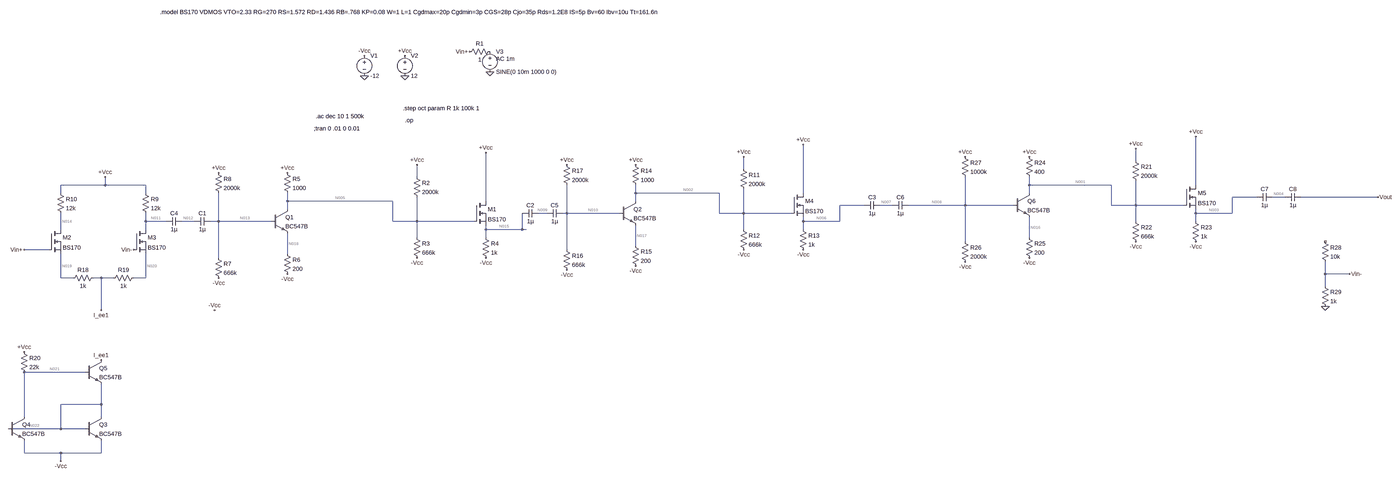
[diagram p0: schematic Draft1.asc, whole sheet]
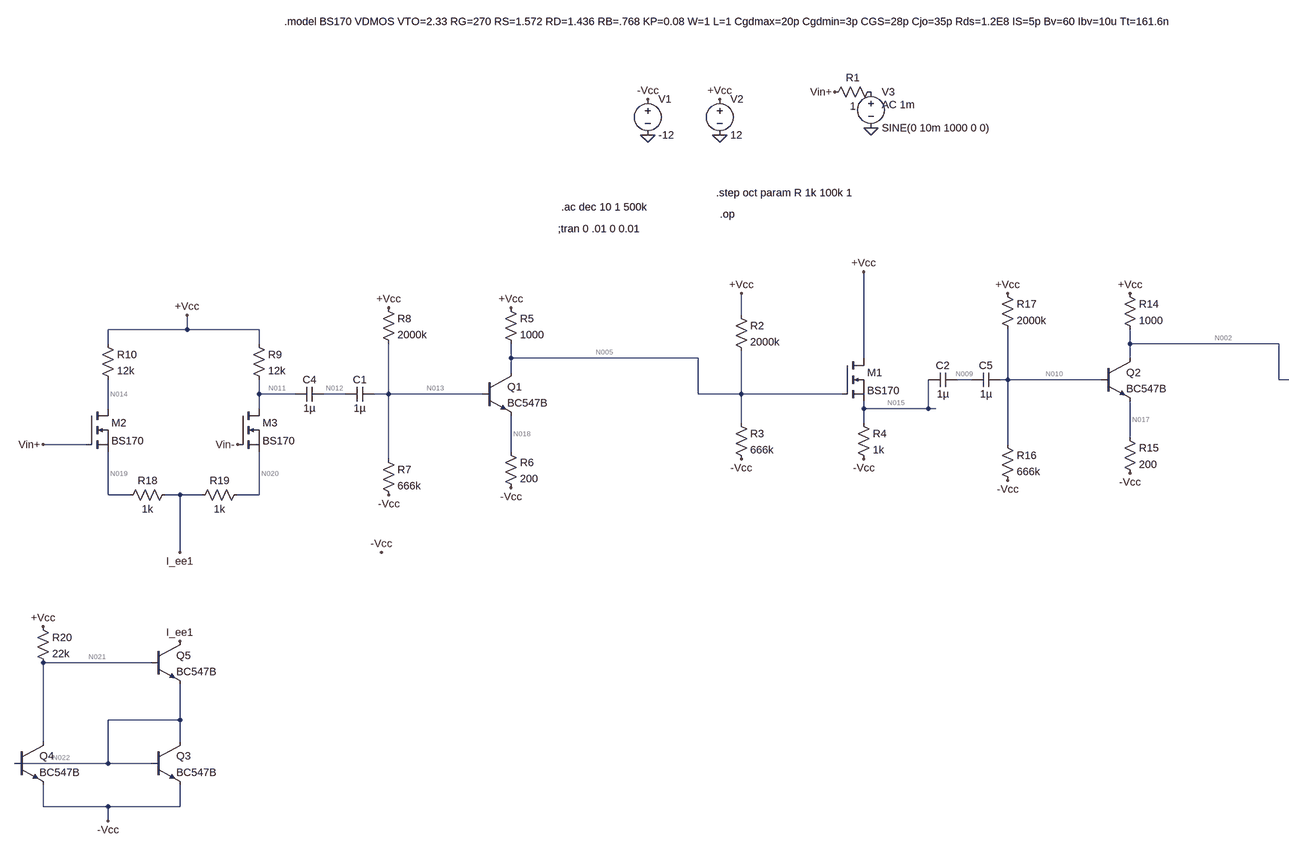
[diagram p1: schematic Draft1.asc, part, row 1 of 1, column 1 of 2]
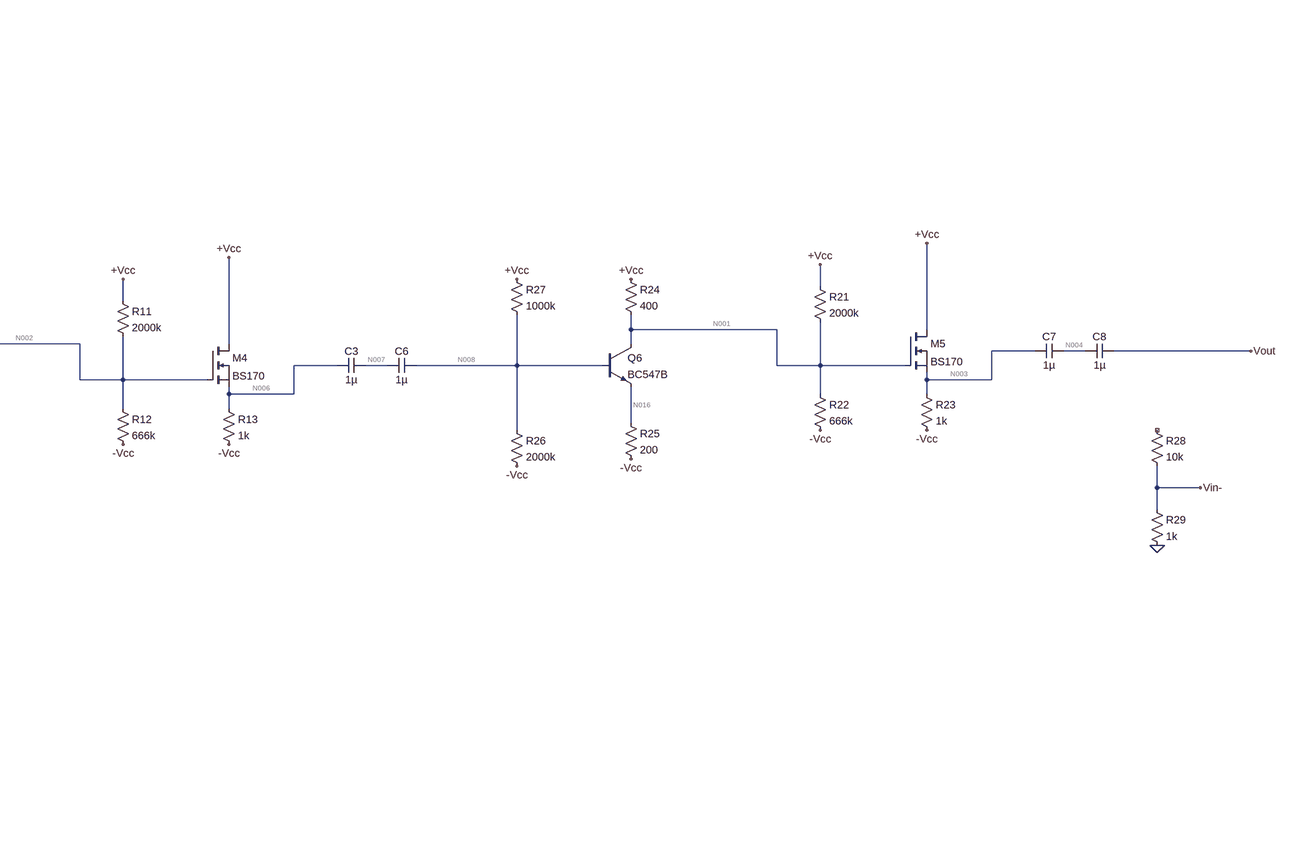
[diagram p2: schematic Draft1.asc, part, row 1 of 1, column 2 of 2]
Draft1.asc, the LTspice schematic file:
Version 4
SHEET 1 4264 680
WIRE 3200 -1136 3200 -1184
WIRE 1504 -1104 1504 -1152
WIRE 128 -1072 128 -1120
WIRE -1104 -1040 -1104 -1072
WIRE -1104 -1040 -1280 -1040
WIRE -944 -1040 -1104 -1040
WIRE 2688 -1040 2688 -1072
WIRE 3104 -1040 2688 -1040
WIRE 3472 -1040 3472 -1232
WIRE -1280 -1008 -1280 -1040
WIRE -944 -1008 -944 -1040
WIRE 992 -1008 992 -1040
WIRE 1408 -1008 992 -1008
WIRE 1776 -1008 1776 -1200
WIRE 2688 -1008 2688 -1040
WIRE 3712 -992 3616 -992
WIRE 3824 -992 3776 -992
WIRE 4192 -992 3888 -992
WIRE -384 -976 -384 -1008
WIRE 32 -976 -384 -976
WIRE 400 -976 400 -1168
WIRE 992 -976 992 -1008
WIRE 2016 -960 1920 -960
WIRE 2128 -960 2080 -960
WIRE 2416 -960 2416 -1072
WIRE 2416 -960 2192 -960
WIRE 2624 -960 2416 -960
WIRE 3104 -960 3104 -1040
WIRE 3200 -960 3200 -1056
WIRE 3200 -960 3104 -960
WIRE 3424 -960 3200 -960
WIRE -384 -944 -384 -976
WIRE 640 -928 608 -928
WIRE 720 -928 720 -1040
WIRE 720 -928 704 -928
WIRE 928 -928 720 -928
WIRE 1408 -928 1408 -1008
WIRE 1504 -928 1504 -1024
WIRE 1504 -928 1408 -928
WIRE 1728 -928 1504 -928
WIRE 3472 -928 3472 -944
WIRE 3616 -928 3616 -992
WIRE 3616 -928 3472 -928
WIRE -944 -896 -944 -928
WIRE -864 -896 -944 -896
WIRE -752 -896 -800 -896
WIRE -656 -896 -656 -1008
WIRE -656 -896 -688 -896
WIRE -448 -896 -656 -896
WIRE 32 -896 32 -976
WIRE 128 -896 128 -992
WIRE 128 -896 32 -896
WIRE 352 -896 128 -896
WIRE 1776 -896 1776 -912
WIRE 1920 -896 1920 -960
WIRE 1920 -896 1776 -896
WIRE 3200 -896 3200 -960
WIRE 3472 -896 3472 -928
WIRE -1280 -864 -1280 -928
WIRE -944 -864 -944 -896
WIRE 400 -864 400 -880
WIRE 544 -864 544 -928
WIRE 544 -864 400 -864
WIRE 560 -864 544 -864
WIRE 1504 -864 1504 -928
WIRE 1776 -864 1776 -896
WIRE 128 -832 128 -896
WIRE 400 -832 400 -864
WIRE 2688 -832 2688 -912
WIRE 2416 -816 2416 -960
WIRE 992 -800 992 -880
WIRE -1328 -784 -1424 -784
WIRE 720 -784 720 -928
WIRE -384 -768 -384 -848
WIRE -656 -752 -656 -896
WIRE 3984 -688 3984 -736
WIRE 4080 -688 3984 -688
WIRE -1280 -672 -1280 -768
WIRE -1232 -672 -1280 -672
WIRE -1120 -672 -1152 -672
WIRE -1072 -672 -1120 -672
WIRE -944 -672 -944 -768
WIRE -944 -672 -992 -672
WIRE 3984 -640 3984 -688
WIRE -1120 -544 -1120 -672
WIRE -1184 -144 -1424 -144
WIRE -1120 -16 -1120 -96
WIRE -1120 -16 -1280 -16
WIRE -1424 32 -1424 -144
WIRE -1120 32 -1120 -16
WIRE -1280 80 -1280 -16
WIRE -1280 80 -1488 80
WIRE -1184 80 -1280 80
WIRE -1424 176 -1424 128
WIRE -1280 176 -1424 176
WIRE -1120 176 -1120 128
WIRE -1120 176 -1280 176
WIRE -1280 208 -1280 176
FLAG -80 -1472 0
FLAG 80 -1472 0
FLAG -80 -1552 -Vcc
FLAG 80 -1552 +Vcc
FLAG 416 -1488 0
FLAG 336 -1568 Vin+
FLAG 128 -1120 +Vcc
FLAG 400 -1168 +Vcc
FLAG -656 -1088 +Vcc
FLAG -384 -1088 +Vcc
FLAG -1104 -1072 +Vcc
FLAG 1504 -1152 +Vcc
FLAG 1776 -1200 +Vcc
FLAG 720 -1120 +Vcc
FLAG 992 -1120 +Vcc
FLAG -1424 -784 Vin+
FLAG -1280 208 -Vcc
FLAG -1424 -224 +Vcc
FLAG -1120 -192 I_ee1
FLAG -1120 -544 I_ee1
FLAG -672 -544 -Vcc
FLAG -656 -672 -Vcc
FLAG -384 -688 -Vcc
FLAG 128 -752 -Vcc
FLAG 400 -752 -Vcc
FLAG 720 -704 -Vcc
FLAG 992 -720 -Vcc
FLAG 1504 -784 -Vcc
FLAG 1776 -784 -Vcc
FLAG -992 -784 Vin-
FLAG 3200 -1184 +Vcc
FLAG 3472 -1232 +Vcc
FLAG 2416 -1152 +Vcc
FLAG 2688 -1152 +Vcc
FLAG 4192 -992 Vout
FLAG 2416 -736 -Vcc
FLAG 2688 -752 -Vcc
FLAG 3200 -816 -Vcc
FLAG 3472 -816 -Vcc
FLAG 4080 -688 Vin-
FLAG 3984 -560 0
SYMBOL voltage -80 -1568 R0
WINDOW 123 0 0 Left 0
WINDOW 39 0 0 Left 0
SYMATTR InstName V1
SYMATTR Value -12
SYMBOL voltage 80 -1568 R0
WINDOW 123 0 0 Left 0
WINDOW 39 0 0 Left 0
SYMATTR InstName V2
SYMATTR Value 12
SYMBOL voltage 416 -1584 R0
WINDOW 123 24 44 Left 2
WINDOW 39 0 0 Left 0
SYMATTR Value2 AC 1m
SYMATTR InstName V3
SYMATTR Value SINE(0 10m 1000 0 0)
SYMBOL res 432 -1584 R90
WINDOW 0 0 56 VBottom 2
WINDOW 3 32 56 VTop 2
SYMATTR InstName R1
SYMATTR Value 1
SYMBOL nmos 352 -976 R0
SYMATTR InstName M1
SYMATTR Value BS170
SYMBOL res 112 -1088 R0
SYMATTR InstName R2
SYMATTR Value 2000k
SYMBOL res 112 -848 R0
SYMATTR InstName R3
SYMATTR Value 666k
SYMBOL res 384 -848 R0
SYMATTR InstName R4
SYMATTR Value 1k
SYMBOL npn -448 -944 R0
SYMATTR InstName Q1
SYMATTR Value BC547B
SYMBOL res -400 -1104 R0
SYMATTR InstName R5
SYMATTR Value 1000
SYMBOL res -400 -784 R0
SYMATTR InstName R6
SYMATTR Value 200
SYMBOL res -672 -768 R0
SYMATTR InstName R7
SYMATTR Value 666k
SYMBOL res -672 -1104 R0
SYMATTR InstName R8
SYMATTR Value 2000k
SYMBOL nmos -1328 -864 R0
SYMATTR InstName M2
SYMATTR Value BS170
SYMBOL res -960 -1024 R0
SYMATTR InstName R9
SYMATTR Value 12k
SYMBOL res -1296 -1024 R0
SYMATTR InstName R10
SYMATTR Value 12k
SYMBOL nmos -992 -864 R0
SYMATTR InstName M3
SYMATTR Value BS170
SYMBOL cap -688 -912 R90
WINDOW 0 0 32 VBottom 2
WINDOW 3 32 32 VTop 2
SYMATTR InstName C1
SYMATTR Value 1µ
SYMBOL nmos 1728 -1008 R0
SYMATTR InstName M4
SYMATTR Value BS170
SYMBOL res 1488 -1120 R0
SYMATTR InstName R11
SYMATTR Value 2000k
SYMBOL res 1488 -880 R0
SYMATTR InstName R12
SYMATTR Value 666k
SYMBOL res 1760 -880 R0
SYMATTR InstName R13
SYMATTR Value 1k
SYMBOL npn 928 -976 R0
SYMATTR InstName Q2
SYMATTR Value BC547B
SYMBOL res 976 -1136 R0
SYMATTR InstName R14
SYMATTR Value 1000
SYMBOL res 976 -816 R0
SYMATTR InstName R15
SYMATTR Value 200
SYMBOL res 704 -800 R0
SYMATTR InstName R16
SYMATTR Value 666k
SYMBOL res 704 -1136 R0
SYMATTR InstName R17
SYMATTR Value 2000k
SYMBOL res -1136 -688 R90
WINDOW 0 0 56 VBottom 2
WINDOW 3 32 56 VTop 2
SYMATTR InstName R18
SYMATTR Value 1k
SYMBOL res -976 -688 R90
WINDOW 0 0 56 VBottom 2
WINDOW 3 32 56 VTop 2
SYMATTR InstName R19
SYMATTR Value 1k
SYMBOL npn -1184 32 R0
SYMATTR InstName Q3
SYMATTR Value BC547B
SYMBOL npn -1488 32 R0
SYMATTR InstName Q4
SYMATTR Value BC547B
SYMBOL npn -1184 -192 R0
SYMATTR InstName Q5
SYMATTR Value BC547B
SYMBOL res -1440 -240 R0
SYMATTR InstName R20
SYMATTR Value 22k
SYMBOL cap 608 -944 R90
WINDOW 0 0 32 VBottom 2
WINDOW 3 32 32 VTop 2
SYMATTR InstName C2
SYMATTR Value 1µ
SYMBOL cap 2080 -976 R90
WINDOW 0 0 32 VBottom 2
WINDOW 3 32 32 VTop 2
SYMATTR InstName C3
SYMATTR Value 1µ
SYMBOL cap -800 -912 R90
WINDOW 0 0 32 VBottom 2
WINDOW 3 32 32 VTop 2
SYMATTR InstName C4
SYMATTR Value 1µ
SYMBOL cap 704 -944 R90
WINDOW 0 0 32 VBottom 2
WINDOW 3 32 32 VTop 2
SYMATTR InstName C5
SYMATTR Value 1µ
SYMBOL cap 2192 -976 R90
WINDOW 0 0 32 VBottom 2
WINDOW 3 32 32 VTop 2
SYMATTR InstName C6
SYMATTR Value 1µ
SYMBOL nmos 3424 -1040 R0
SYMATTR InstName M5
SYMATTR Value BS170
SYMBOL res 3184 -1152 R0
SYMATTR InstName R21
SYMATTR Value 2000k
SYMBOL res 3184 -912 R0
SYMATTR InstName R22
SYMATTR Value 666k
SYMBOL res 3456 -912 R0
SYMATTR InstName R23
SYMATTR Value 1k
SYMBOL npn 2624 -1008 R0
SYMATTR InstName Q6
SYMATTR Value BC547B
SYMBOL res 2672 -1168 R0
SYMATTR InstName R24
SYMATTR Value 400
SYMBOL res 2672 -848 R0
SYMATTR InstName R25
SYMATTR Value 200
SYMBOL res 2400 -832 R0
SYMATTR InstName R26
SYMATTR Value 2000k
SYMBOL res 2400 -1168 R0
SYMATTR InstName R27
SYMATTR Value 1000k
SYMBOL cap 3776 -1008 R90
WINDOW 0 0 32 VBottom 2
WINDOW 3 32 32 VTop 2
SYMATTR InstName C7
SYMATTR Value 1µ
SYMBOL cap 3888 -1008 R90
WINDOW 0 0 32 VBottom 2
WINDOW 3 32 32 VTop 2
SYMATTR InstName C8
SYMATTR Value 1µ
SYMBOL res 3968 -832 R0
SYMATTR InstName R28
SYMATTR Value 10k
SYMBOL res 3968 -656 R0
SYMATTR InstName R29
SYMATTR Value 1k
TEXT -280 -1264 Left 2 !;tran 0 .01 0 0.01
TEXT -888 -1760 Left 2 !.model BS170 VDMOS VTO=2.33 RG=270 RS=1.572 RD=1.436 RB=.768 KP=0.08 W=1 L=1 Cgdmax=20p Cgdmin=3p CGS=28p Cjo=35p Rds=1.2E8 IS=5p Bv=60 Ibv=10u Tt=161.6n
TEXT -272 -1312 Left 2 !.ac dec 10 1 500k
TEXT 72 -1344 Left 2 !.step oct param R 1k 100k 1
TEXT 80 -1296 Left 2 !.op

The netlist it stands for:
* Draft1.asc
V1 -Vcc 0 -12
V2 +Vcc 0 12
V3 P001 0 SINE(0 10m 1000 0 0) AC 1m
R1 P001 Vin+ 1
M1 +Vcc N005 N015 N015 BS170
R2 +Vcc N005 2000k
R3 N005 -Vcc 666k
R4 N015 -Vcc 1k
Q1 N005 N013 N018 0 BC547B
R5 +Vcc N005 1000
R6 N018 -Vcc 200
R7 N013 -Vcc 666k
R8 +Vcc N013 2000k
M2 N014 Vin+ N019 N019 BS170
R9 +Vcc N011 12k
R10 +Vcc N014 12k
M3 N011 Vin- N020 N020 BS170
C1 N013 N012 1µ
M4 +Vcc N002 N006 N006 BS170
R11 +Vcc N002 2000k
R12 N002 -Vcc 666k
R13 N006 -Vcc 1k
Q2 N002 N010 N017 0 BC547B
R14 +Vcc N002 1000
R15 N017 -Vcc 200
R16 N010 -Vcc 666k
R17 +Vcc N010 2000k
R18 I_ee1 N019 1k
R19 N020 I_ee1 1k
Q3 N022 N022 -Vcc 0 BC547B
Q4 N021 N022 -Vcc 0 BC547B
Q5 I_ee1 N021 N022 0 BC547B
R20 +Vcc N021 22k
C2 N009 N015 1µ
C3 N007 N006 1µ
C4 N012 N011 1µ
C5 N010 N009 1µ
C6 N008 N007 1µ
M5 +Vcc N001 N003 N003 BS170
R21 +Vcc N001 2000k
R22 N001 -Vcc 666k
R23 N003 -Vcc 1k
Q6 N001 N008 N016 0 BC547B
R24 +Vcc N001 400
R25 N016 -Vcc 200
R26 N008 -Vcc 2000k
R27 +Vcc N008 1000k
C7 N004 N003 1µ
C8 Vout N004 1µ
R28 NC_01 Vin- 10k
R29 Vin- 0 1k
.model NPN NPN
.model PNP PNP
.lib standard.bjt
.model NMOS NMOS
.model PMOS PMOS
.lib standard.mos
;tran 0 .01 0 0.01
.model BS170 VDMOS VTO=2.33 RG=270 RS=1.572 RD=1.436 RB=.768 KP=0.08 W=1 L=1 Cgdmax=20p Cgdmin=3p CGS=28p Cjo=35p Rds=1.2E8 IS=5p Bv=60 Ibv=10u Tt=161.6n
.ac dec 10 1 500k
.step oct param R 1k 100k 1
.op
.backanno
.end

* Results of the author's LTspice run, read from the files saved beside the schematic
* Operating Point (first step), zero values left out:
*   r = 1 k
*   V(-vcc) = -12 V
*   V(+vcc) = 12 V
*   V(n005) = 8.562 V
*   V(n015) = 5.542 V
*   V(n013) = -10.65 V
*   V(n018) = -11.32 V
*   V(n014) = 5.86 V
*   V(n019) = -2.444 V
*   V(n011) = 5.86 V
*   V(n020) = -2.444 V
*   V(n012) = -4.791 µV
*   V(n002) = 8.562 V
*   V(n006) = 5.542 V
*   V(n010) = -10.65 V
*   V(n017) = -11.32 V
*   V(i_ee1) = -2.956 V
*   V(n022) = -11.36 V
*   V(n021) = -10.72 V
*   V(n009) = -5.109 µV
*   V(n007) = -4.284 µV
*   V(n008) = -9.826 V
*   V(n001) = 9.025 V
*   V(n003) = 5.996 V
*   V(n016) = -10.51 V
*   V(n004) = 5.996 µV
*   Ic(Q6) = 7.406 mA
*   Ib(Q6) = 20.74 µA
*   Ie(Q6) = -7.427 mA
*   Ic(Q5) = 1.023 mA
*   Ib(Q5) = 3.218 µA
*   Ie(Q5) = -1.027 mA
*   Ic(Q4) = 1.03 mA
*   Ib(Q4) = 3.611 µA
*   Ie(Q4) = -1.033 mA
*   Ic(Q3) = 1.019 mA
*   Ib(Q3) = 3.611 µA
*   Ie(Q3) = -1.023 mA
*   Ic(Q2) = 3.409 mA
*   Ib(Q2) = 9.3 µA
*   Ie(Q2) = -3.418 mA
*   Ic(Q1) = 3.409 mA
*   Ib(Q1) = 9.3 µA
*   Ie(Q1) = -3.418 mA
*   Id(M5) = 18 mA
*   Ig(M5) = -5.162 pA
*   Is(M5) = -18 mA
*   Id(M4) = 17.54 mA
*   Ig(M4) = -4.885 pA
*   Is(M4) = -17.54 mA
*   Id(M3) = 511.7 µA
*   Ig(M3) = -4.118 pA
*   Is(M3) = -511.7 µA
*   Id(M2) = 511.7 µA
*   Ig(M2) = -4.118 pA
*   Is(M2) = -511.7 µA
*   Id(M1) = 17.54 mA
*   Ig(M1) = -4.885 pA
*   Is(M1) = -17.54 mA
*   I(R27) = 21.83 µA
*   I(R26) = 1.087 µA
*   I(R25) = 7.427 mA
*   I(R24) = 7.436 mA
*   I(R23) = 18 mA
*   I(R22) = 31.57 µA
*   I(R21) = 1.487 µA
*   I(R20) = 1.033 mA
*   I(R19) = 511.7 µA
*   I(R18) = -511.7 µA
*   I(R17) = 11.33 µA
*   I(R16) = 2.026 µA
*   I(R15) = 3.418 mA
*   I(R14) = 3.438 mA
*   I(R13) = 17.54 mA
*   I(R12) = 30.87 µA
*   I(R11) = 1.719 µA
*   I(R10) = 511.7 µA
*   I(R9) = 511.7 µA
*   I(R8) = 11.33 µA
*   I(R7) = 2.026 µA
*   I(R6) = 3.418 mA
*   I(R5) = 3.438 mA
*   I(R4) = 17.54 mA
*   I(R3) = 30.87 µA
*   I(R2) = 1.719 µA
*   I(V2) = -69.5 mA
*   I(V1) = 69.5 mA
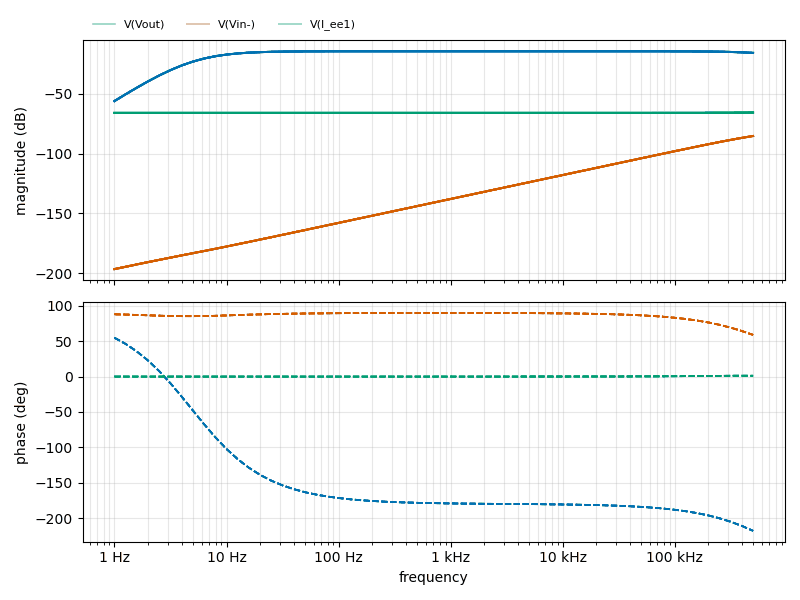
[diagram p3: AC Analysis of Draft1.asc, plotted from the saved traces]
* AC Analysis, 8 runs:
*   V(Vout) [r=1000]: -56.13 dB at 1 Hz, -15.84 dB at 500 kHz, peak -14.47 dB at 2.512 kHz, 3 dB below the peak at 9.619 Hz
*   V(Vout) [r=2000]: -56.13 dB at 1 Hz, -15.84 dB at 500 kHz, peak -14.47 dB at 2.512 kHz, 3 dB below the peak at 9.619 Hz
*   V(Vout) [r=4000]: -56.13 dB at 1 Hz, -15.84 dB at 500 kHz, peak -14.47 dB at 2.512 kHz, 3 dB below the peak at 9.619 Hz
*   V(Vout) [r=8000]: -56.13 dB at 1 Hz, -15.84 dB at 500 kHz, peak -14.47 dB at 2.512 kHz, 3 dB below the peak at 9.619 Hz
*   V(Vout) [r=16000]: -56.13 dB at 1 Hz, -15.84 dB at 500 kHz, peak -14.47 dB at 2.512 kHz, 3 dB below the peak at 9.619 Hz
*   V(Vout) [r=32000]: -56.13 dB at 1 Hz, -15.84 dB at 500 kHz, peak -14.47 dB at 2.512 kHz, 3 dB below the peak at 9.619 Hz
*   V(Vout) [r=64000]: -56.13 dB at 1 Hz, -15.84 dB at 500 kHz, peak -14.47 dB at 2.512 kHz, 3 dB below the peak at 9.619 Hz
*   V(Vout) [r=100000]: -56.13 dB at 1 Hz, -15.84 dB at 500 kHz, peak -14.47 dB at 2.512 kHz, 3 dB below the peak at 9.619 Hz
*   V(Vin-) [r=1000]: -196.64 dB at 1 Hz, -85.36 dB at 500 kHz, peak -85.36 dB at 500 kHz, 3 dB below the peak at 325.5 kHz
*   V(Vin-) [r=2000]: -196.64 dB at 1 Hz, -85.36 dB at 500 kHz, peak -85.36 dB at 500 kHz, 3 dB below the peak at 325.5 kHz
*   V(Vin-) [r=4000]: -196.64 dB at 1 Hz, -85.36 dB at 500 kHz, peak -85.36 dB at 500 kHz, 3 dB below the peak at 325.5 kHz
*   V(Vin-) [r=8000]: -196.64 dB at 1 Hz, -85.36 dB at 500 kHz, peak -85.36 dB at 500 kHz, 3 dB below the peak at 325.5 kHz
*   V(Vin-) [r=16000]: -196.64 dB at 1 Hz, -85.36 dB at 500 kHz, peak -85.36 dB at 500 kHz, 3 dB below the peak at 325.5 kHz
*   V(Vin-) [r=32000]: -196.64 dB at 1 Hz, -85.36 dB at 500 kHz, peak -85.36 dB at 500 kHz, 3 dB below the peak at 325.5 kHz
*   V(Vin-) [r=64000]: -196.64 dB at 1 Hz, -85.36 dB at 500 kHz, peak -85.36 dB at 500 kHz, 3 dB below the peak at 325.5 kHz
*   V(Vin-) [r=100000]: -196.64 dB at 1 Hz, -85.36 dB at 500 kHz, peak -85.36 dB at 500 kHz, 3 dB below the peak at 325.5 kHz
*   V(I_ee1) [r=1000]: -66.02 dB at 1 Hz, -65.74 dB at 500 kHz, peak -65.74 dB at 500 kHz
*   V(I_ee1) [r=2000]: -66.02 dB at 1 Hz, -65.74 dB at 500 kHz, peak -65.74 dB at 500 kHz
*   V(I_ee1) [r=4000]: -66.02 dB at 1 Hz, -65.74 dB at 500 kHz, peak -65.74 dB at 500 kHz
*   V(I_ee1) [r=8000]: -66.02 dB at 1 Hz, -65.74 dB at 500 kHz, peak -65.74 dB at 500 kHz
*   V(I_ee1) [r=16000]: -66.02 dB at 1 Hz, -65.74 dB at 500 kHz, peak -65.74 dB at 500 kHz
*   V(I_ee1) [r=32000]: -66.02 dB at 1 Hz, -65.74 dB at 500 kHz, peak -65.74 dB at 500 kHz
*   V(I_ee1) [r=64000]: -66.02 dB at 1 Hz, -65.74 dB at 500 kHz, peak -65.74 dB at 500 kHz
*   V(I_ee1) [r=100000]: -66.02 dB at 1 Hz, -65.74 dB at 500 kHz, peak -65.74 dB at 500 kHz
* From the log:
*   Semiconductor Device Operating Points:
*                           --- Bipolar Transistors ---
*   Name:       q6          q5          q4          q3          q2
*   Model:    bc547b      bc547b      bc547b      bc547b      bc547b
*   Ib:       2.07e-05    3.22e-06    3.61e-06    3.61e-06    9.30e-06
*   Ic:       7.41e-03    1.02e-03    1.03e-03    1.02e-03    3.41e-03
*   Vbe:      6.88e-01    6.36e-01    6.39e-01    6.39e-01    6.65e-01
*   Vbc:     -1.89e+01   -7.77e+00   -6.36e-01    0.00e+00   -1.92e+01
*   Vce:      1.95e+01    8.40e+00    1.28e+00    6.39e-01    1.99e+01
*   BetaDC:   3.57e+02    3.18e+02    2.85e+02    2.82e+02    3.67e+02
*   Gm:       2.73e-01    3.89e-02    3.91e-02    3.87e-02    1.28e-01
*   Rpi:      1.26e+03    8.13e+03    7.24e+03    7.24e+03    2.81e+03
*   Rx:       1.00e+00    1.00e+00    1.00e+00    1.00e+00    1.00e+00
*   Ro:       1.09e+04    6.78e+04    6.05e+04    6.05e+04    2.37e+04
*   Cbe:      1.87e-10    6.16e-11    6.31e-11    6.29e-11    1.14e-10
*   Cbc:      7.35e-13    9.47e-13    1.74e-12    2.31e-12    7.31e-13
*   Cjs:      0.00e+00    0.00e+00    0.00e+00    0.00e+00    0.00e+00
*   BetaAC:   3.43e+02    3.16e+02    2.84e+02    2.81e+02    3.60e+02
*   Cbx:      4.52e-13    5.82e-13    1.07e-12    1.42e-12    4.49e-13
*   Ft:       2.31e+08    9.81e+07    9.45e+07    9.25e+07    1.78e+08
*   Name:       q1
*   Model:    bc547b
*   Ib:       9.30e-06
*   Ic:       3.41e-03
*   Vbe:      6.65e-01
*   Vbc:     -1.92e+01
*   Vce:      1.99e+01
*   BetaDC:   3.67e+02
*   Gm:       1.28e-01
*   Rpi:      2.81e+03
*   Rx:       1.00e+00
*   Ro:       2.37e+04
*   Cbe:      1.14e-10
*   Cbc:      7.31e-13
*   Cjs:      0.00e+00
*   BetaAC:   3.60e+02
*   Cbx:      4.49e-13
*   Ft:       1.78e+08
*                           --- VDMOSFET Transistors ---
*   Name:          m5          m4          m3          m2          m1
*   Model:        bs170       bs170       bs170       bs170       bs170
*   Id:          1.80e-02    1.75e-02    5.12e-04    5.12e-04    1.75e-02
*   Vgs:         3.03e+00    3.02e+00    2.44e+00    2.44e+00    3.02e+00
*   Vds:         6.00e+00    6.46e+00    8.30e+00    8.30e+00    6.46e+00
*   Vth:         2.33e+00    2.33e+00    2.33e+00    2.33e+00    2.33e+00
*   Gm:          5.37e-02    5.30e-02    9.05e-03    9.05e-03    5.30e-02
*   Gds:         0.00e+00    0.00e+00    0.00e+00    0.00e+00    0.00e+00
*   Cgs:         2.80e-11    2.80e-11    2.80e-11    2.80e-11    2.80e-11
*   Cgd:         5.16e-12    4.88e-12    4.12e-12    4.12e-12    4.88e-12
*   Cbody:       1.32e-11    1.28e-11    1.15e-11    1.15e-11    1.28e-11